# EAGLE design I2C Line Sensor (EAGLE 6.4)
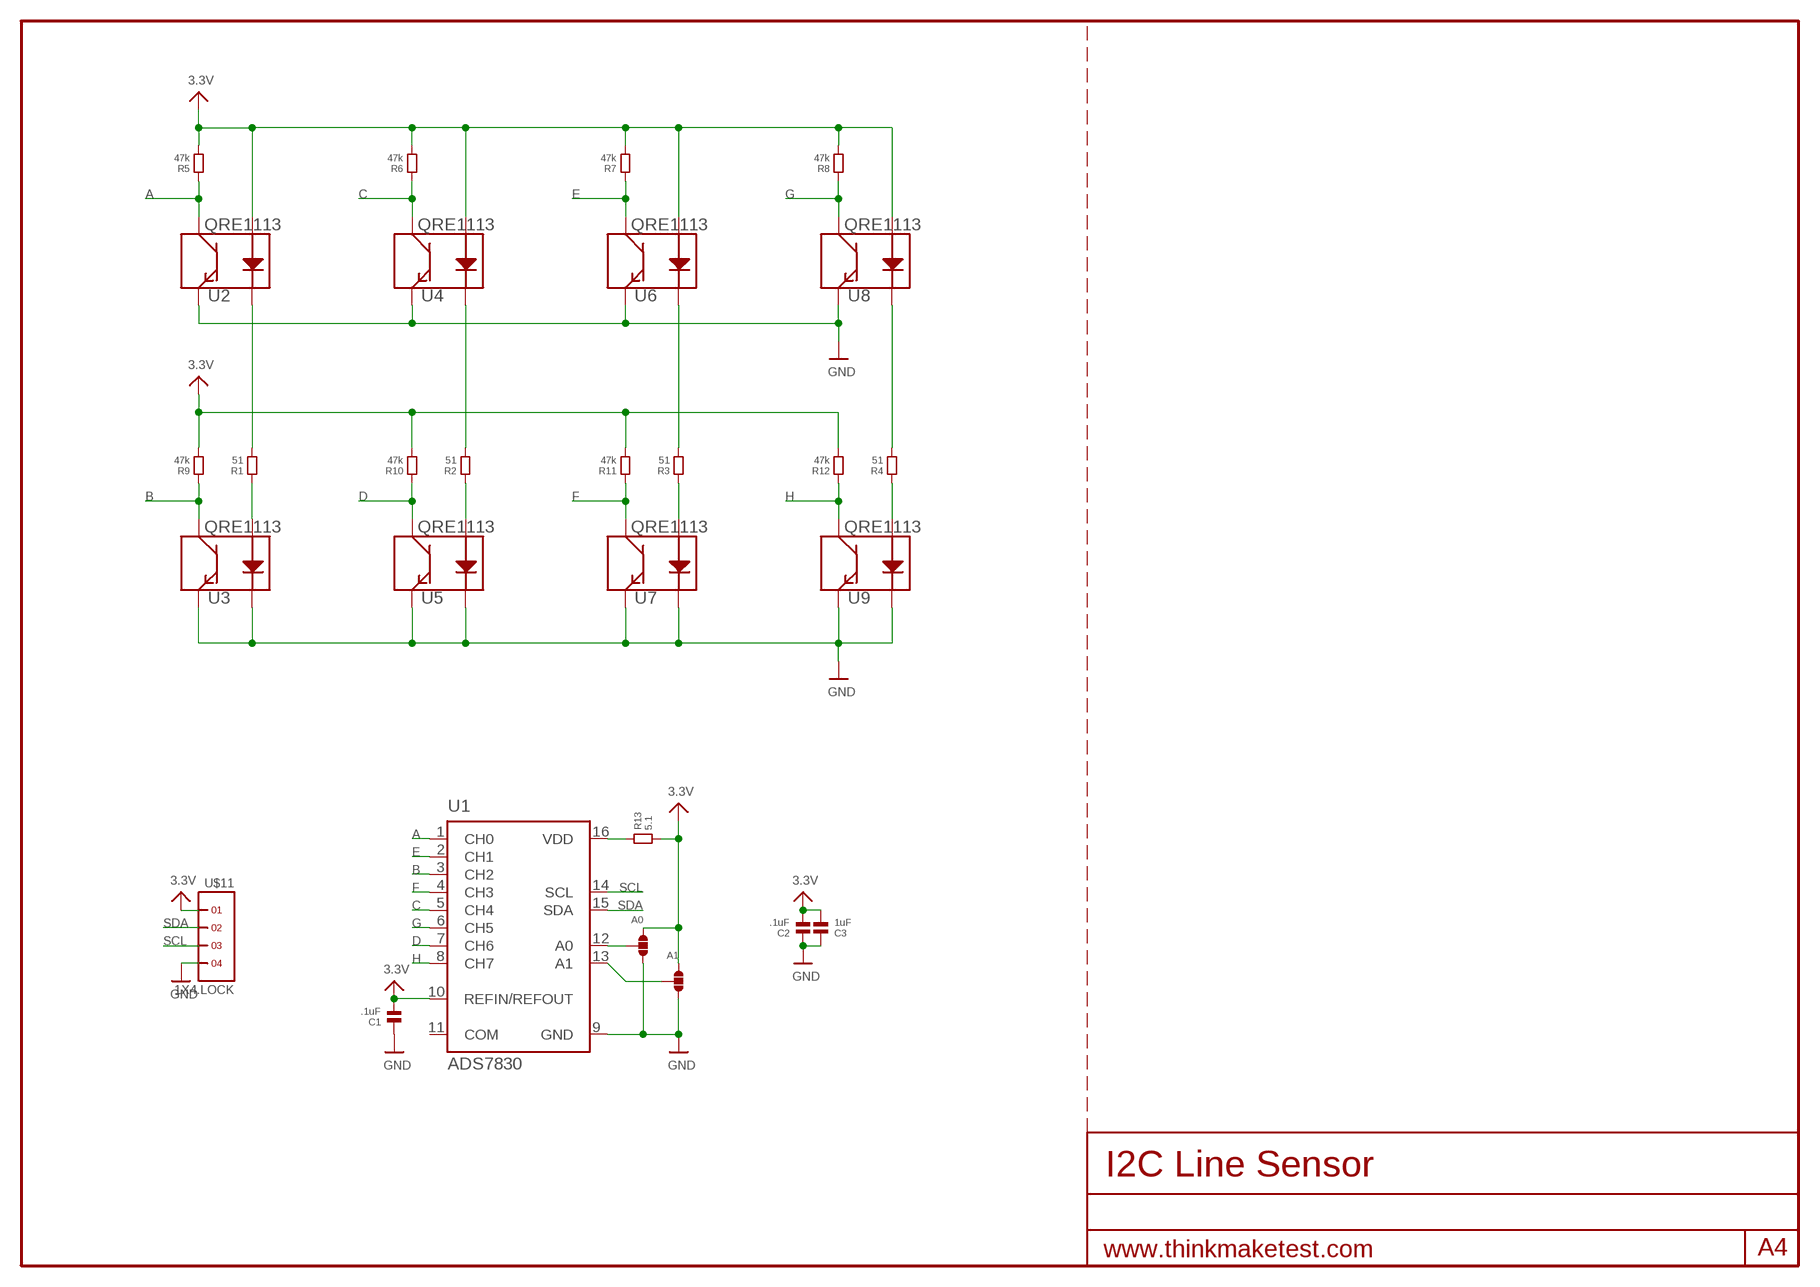
[diagram p0: schematic, sheet 1]

## Parts
A0  SOLDERJUMPER.3.LRG.23  [3.LRG.23]
A1  SOLDERJUMPER.3.LRG.23  [3.LRG.23]
C1  .1uF  CAPACITOR.0603  [0603]
C2  .1uF  CAPACITOR.0603  [0603]
C3  1uF  CAPACITOR.0603  [0603]
R1  51  RESISTOR.0603  [0603]
R2  51  RESISTOR.0603  [0603]
R3  51  RESISTOR.0603  [0603]
R4  51  RESISTOR.0603  [0603]
R5  47k  RESISTOR.0603  [0603]
R6  47k  RESISTOR.0603  [0603]
R7  47k  RESISTOR.0603  [0603]
R8  47k  RESISTOR.0603  [0603]
R9  47k  RESISTOR.0603  [0603]
R10  47k  RESISTOR.0603  [0603]
R11  47k  RESISTOR.0603  [0603]
R12  47k  RESISTOR.0603  [0603]
R13  5.1  RESISTOR.0603  [0603]
U1  ADS7830  ADS7828  [TSSOP16-PW]
U2  QRE1113  [QRE1113]
U3  QRE1113  [QRE1113]
U4  QRE1113  [QRE1113]
U5  QRE1113  [QRE1113]
U6  QRE1113  [QRE1113]
U7  QRE1113  [QRE1113]
U8  QRE1113  [QRE1113]
U9  QRE1113  [QRE1113]
U$11  1X4.LOCK  [1X4.LOCK]

## Nets
3.3V: A0.1 A1.1 C1.2 C2.2 C3.2 R5.2 R6.2 R7.2 R8.2 R9.2 R10.2 R11.2 R12.2 R13.2 U1.10(REFIN/REFOUT) U2.1(A) U4.1(A) U6.1(A) U8.1(A) U$11.1
A: R5.1 U1.1(CH0) U2.3(C)
B: R9.1 U1.3(CH2) U3.3(C)
C: R6.1 U1.5(CH4) U4.3(C)
D: R10.1 U1.7(CH6) U5.3(C)
E: R7.1 U1.2(CH1) U6.3(C)
F: R11.1 U1.4(CH3) U7.3(C)
G: R8.1 U1.6(CH5) U8.3(C)
GND: A0.3 A1.3 C1.1 C2.1 C3.1 U1.9(GND) U2.4(E) U3.2(K) U3.4(E) U4.4(E) U5.2(K) U5.4(E) U6.4(E) U7.2(K) U7.4(E) U8.4(E) U9.2(K) U9.4(E) U$11.4
H: R12.1 U1.8(CH7) U9.3(C)
N$1: A0.2 U1.12(A0)
N$2: R1.2 U2.2(K)
N$3: R1.1 U3.1(A)
N$4: R2.1 U5.1(A)
N$5: R2.2 U4.2(K)
N$6: R3.2 U6.2(K)
N$7: R3.1 U7.1(A)
N$8: R4.2 U8.2(K)
N$9: R4.1 U9.1(A)
N$10: A1.2 U1.13(A1)
N$15: R13.1 U1.16(VDD)
SCL: U1.14(SCL) U$11.3
SDA: U1.15(SDA) U$11.2
Unconnected: U1.11(COM)

## Library data of the parts
A0 A1 = .solderjumper:SOLDERJUMPER.3
C1-C3 = standardparts:CAPACITOR
R1-R13 = standardparts:RESISTOR
U1 = burr-brown:ADS7828: 12-Bit, 8-Channel Sampling ANALOG-TO-DIGITAL CONVERTER with I2C? Interface Source: www.ti.com .. ADS7828.pdf
U2-U9 = SparkFun:QRE1113
U$11 = headers(.1in):1X4

## Board
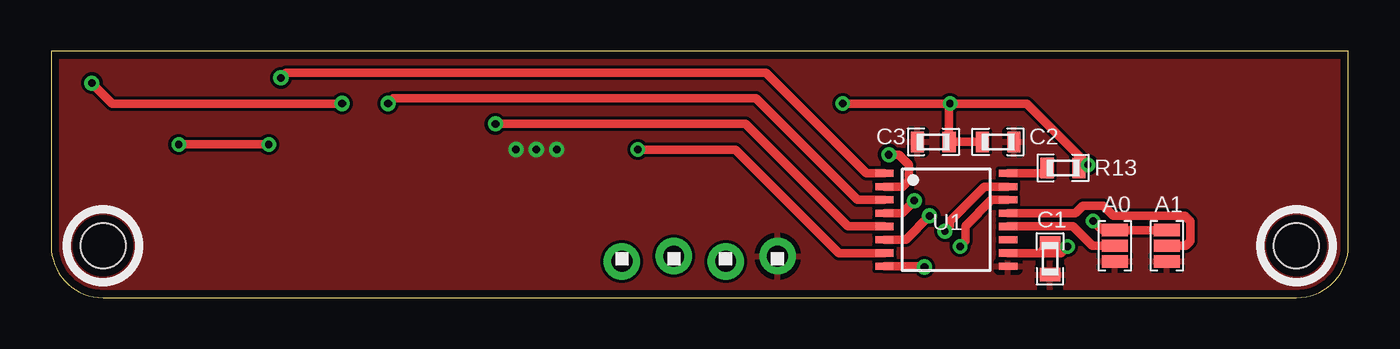
[diagram p1: board, top side]
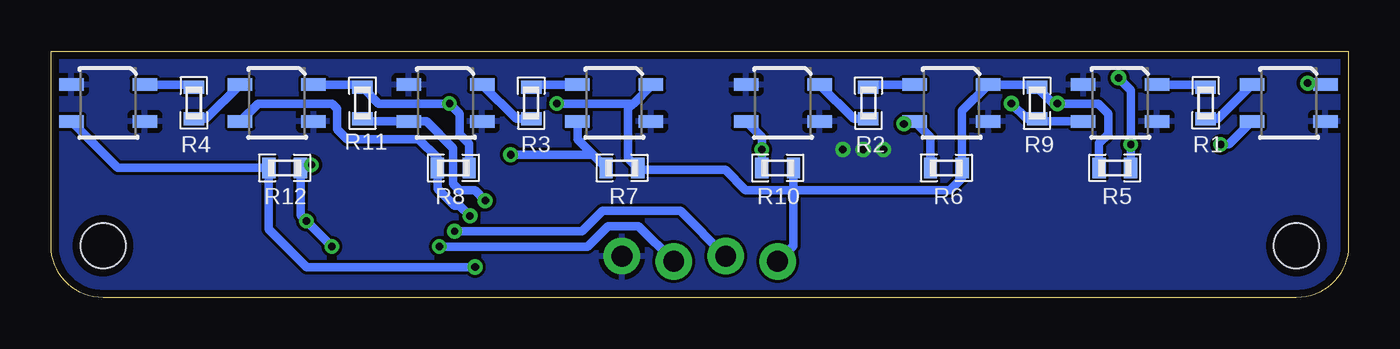
[diagram p2: board, bottom side, seen from below]

Size 63.5 x 12.06 mm. Coordinates in mm from the lower left corner, seen from the top.
Outline: 63.5,12.06 0,12.06 0,2.54 arc90 2.54,0 60.96,0 arc90 63.5,2.54 63.5,12.06
Copper layers (1*16): Top 0.0356mm / dielectric 1.5011mm / Bottom 0.0356mm
Design rules "OSHPark": minimum track width 6mil, minimum drill 13mil, track to track 6mil, track to pad 6mil, pad to pad 6mil, via to via 6mil, smd to smd 6mil, copper to edge 15mil, drill to drill 6mil, minimum pad ring 7mil, minimum via ring 7mil, stop-mask expansion 4mil, vias tented up to drill 16mil, thermal gap 10mil
Holes 2.2 mm at 2.54,2.54 60.96,2.54

### Footprints (pad centres in the part's own frame; a part is rotated, then mirrored left to right if it is on the bottom)
3.LRG.23 = smd 0.61 x 1.27: 1 -0.762,0; 2 0,0; 3 0.762,0
0603 = smd 0.65 x 1: 1 -0.775,0; 2 0.775,0
TSSOP16-PW = smd 0.35 x 0.9: 1 -2.275,-3.025; 2 -1.625,-3.025; 3 -0.975,-3.025; 4 -0.325,-3.025; 5 0.325,-3.025; 6 0.975,-3.025; 7 1.625,-3.025; 8 2.275,-3.025; 9 2.275,3.025; 10 1.625,3.025; 11 0.975,3.025; 12 0.325,3.025; 13 -0.325,3.025; 14 -0.975,3.025; 15 -1.625,3.025; 16 -2.275,3.025
QRE1113 = smd 1.2 x 0.6: 1 -1.8,-0.9; 2 1.8,-0.9; 3 1.8,0.9; 4 -1.8,0.9
1X4.LOCK = drill 1.016 pad 1.778: 1 0,-0.127; 2 2.54,0.127; 3 5.08,-0.127; 4 7.62,0.127

### Placement (x,y rotation side)
A0  52.07,2.54 270 top
A1  54.61,2.54 270 top
C1  48.9,1.91 90 top
C2  46.35,7.62 180 top
C3  43.18,7.62 0 top
R1  6.99,9.53 270 bottom
R2  23.5,9.53 90 bottom
R3  40.01,9.53 90 bottom
R4  56.52,9.53 270 bottom
R5  11.43,6.35 180 bottom
R6  19.68,6.35 0 bottom
R7  35.56,6.35 0 bottom
R8  43.81,6.35 0 bottom
R9  15.24,9.53 90 bottom
R10  27.94,6.35 0 bottom
R11  48.26,9.53 90 bottom
R12  52.07,6.35 0 bottom
R13  49.53,6.35 0 top
U1  43.81,3.81 270 top
U2  2.92,9.53 180 bottom
U3  11.18,9.53 180 bottom
U4  19.43,9.53 180 bottom
U5  27.69,9.53 180 bottom
U6  35.94,9.53 180 bottom
U7  44.2,9.53 180 bottom
U8  52.45,9.53 180 bottom
U9  60.71,9.53 180 bottom
U$11  27.94,1.91 0 top

### Tracks (layer width: path | path; a pad name or v marks a point on that pad's centre or on a via)
3.3V  (via drill 0.36, 0.38)
  Top 0.406: v2,10.5 3,9.5 v14.25,9.5 | C3.2 C2.2 | v44,9.5 v38.75,9.5 | 48.4,2.19 C1.2 arc-90 48.97,2.75 | 48.4,2.19 U1.10 | A1.1 A0.1 51.45,3.3 v51,3.75 | R13.2 50.3,6.95 | v49.75,2.5 49.44,2.19 48.4,2.19 | C3.2 43.95,7.46 | C3.2 43.95,9.46 v44,9.5 | v50.75,6.5 50.3,6.95 | v44,9.5 47.75,9.5 50.3,6.95
  Bottom 0.406: U8.1 48.38,10.43 R11.2 47.46,9.5 v44,9.5 43.5,9 43.5,8 43.04,7.54 R8.2 | U2.1 1.2,10.5 v2,10.5 | U6.1 34.14,10.36 35,9.5 | 35,9.5 35.25,9.25 35.25,6.82 R7.2 34.69,6.25 30.5,6.25 29.5,5.25 27.16,5.25 | v38.75,9.5 35,9.5 | v49.75,2.5 v51,3.75 51.3,4.04 R12.2 50.9,6.35 v50.75,6.5 | R5.2 12.21,7.54 11.75,8 11.75,9 12.25,9.5 v14.25,9.5 14.44,9.5 R9.2 15.37,10.43 U4.1 18.91,9.15 R6.2 18.91,5.84 19.5,5.25 27.16,5.25 | U$11.1 27.16,2.55 27.16,5.25 | 27.16,5.25 R10.2
A  (via drill 0.36, 0.38)
  Top 0.406: U1.1 39.91,6.08 35,11 11.5,11 v11.25,10.75 | v6.25,7.5 v10.65,7.5
  Bottom 0.406: R5.1 v10.65,7.5 10.65,8 10.65,10.15 v11.25,10.75 | U2.3 5.85,7.5 v6.25,7.5
B  (via drill 0.38)
  Top 0.406: U1.3 39.47,4.79 34.5,9.75 16.75,9.75 v16.5,9.5
  Bottom 0.406: U3.3 15.12,8.62 R9.1 15.75,8.75 v16.5,9.5
C  (via drill 0.38)
  Top 0.406: U1.5 39.02,3.48 34,8.5 v21.75,8.5
  Bottom 0.406: v21.75,8.5 21.62,8.62 U4.3 20.46,7.85 R6.1
D  (via drill 0.36)
  Top 0.406: U1.7 38.56,2.19 33.5,7.25 v28.71,7.25
  Bottom 0.406: U5.3 28.71,7.85 v28.71,7.25 R10.1
E  (via drill 0.38)
  Top 0.406: U1.2 41.69,5.43 42,5.75 42,6.5 41.5,7 v41,7
  Bottom 0.406: R7.1 36.99,7.01 | 36.99,7.01 37.74,7.76 U6.3 | v41,7 37,7 36.99,7.01
F  (via drill 0.38)
  Top 0.406: U1.4 41.63,4.13 v42.25,4.75
  Bottom 0.406: R11.1 48.13,8.62 U7.3 45.12,8.62 43.81,7.32 43.81,5.57 43.5,5.25 42.75,5.25 v42.25,4.75
G  (via drill 0.38)
  Top 0.406: U1.6 41.84,2.83 v43,4
  Bottom 0.406: U8.3 53.38,9.5 49.75,9.5 49.5,9.25 49.5,8.25 49,7.75 45.5,7.75 44.59,6.84 R8.1 44.59,5.34 43.75,4.5 43.5,4.5 v43,4
GND  (via drill 0.38)
  other vias: 22.75,7.25 23.75,7.25 24.75,7.25
  pour Top (rank 6): 0,12.06 63.5,12.06 63.5,2.54 arc-90 60.96,0 2.54,0 arc-90 0,2.54
  pour Bottom: 0,12.06 63.5,12.06 63.5,0 0,0
H  (via drill 0.38)
  Top 0.406: U1.8 42.72,1.53 v42.75,1.5
  Bottom 0.406: v42.75,1.5 51,1.5 52.84,3.35 R12.1 60.23,6.35 U9.3
N$1
  Top 0.406: A0.2 50.96,2.54 50.02,3.48 U1.12
N$2
  Bottom 0.406: U2.2 6.4,8.75 R1.2
N$3
  Bottom 0.406: R1.1 7.11,10.43 U3.1
N$4
  Bottom 0.406: U5.1 24.21,8.75 R2.1
N$5
  Bottom 0.406: R2.2 23.37,10.43 U4.2
N$6
  Bottom 0.406: R3.2 39.88,10.43 U6.2
N$7
  Bottom 0.406: U7.1 40.72,8.75 R3.1
N$8
  Bottom 0.406: U8.2 55.93,8.75 R4.2
N$9
  Bottom 0.406: R4.1 56.64,10.43 U9.1
N$10
  Top 0.406: A1.2 55.54,2.54 55.75,2.75 55.75,3.75 55.5,4 52,4 51.5,4.5 50.5,4.5 50.13,4.13 U1.13
N$15
  Top 0.406: U1.16 48.49,6.08 R13.1
SCL  (via drill 0.36)
  Top 0.406: U1.14 46.03,4.79 44.75,3.5 44.75,2.75 v44.5,2.5
  Bottom 0.406: U$11.3 34.74,3.5 36.25,3.5 37.25,2.5 v44.5,2.5
SDA  (via drill 0.36)
  Top 0.406: U1.15 45.69,5.43 44,3.75 44,3.5 v43.75,3.25
  Bottom 0.406: U$11.2 32.7,4.25 36.5,4.25 37.5,3.25 v43.75,3.25

### Text on the board
tDocu: + | 1 | + | 2 | + | 3 | + | 4 | 5 | + | 6 | + | 7 | + | 8 | + | VCC | SDA | SCL | GND | I2C Line / Sensor
bDocu: AnomalousMaker.com | Cruz Monrreal II